# Altium schematic sheet LCD.SchDoc
size A4; SheetNumber: 6; SheetTotal: 8
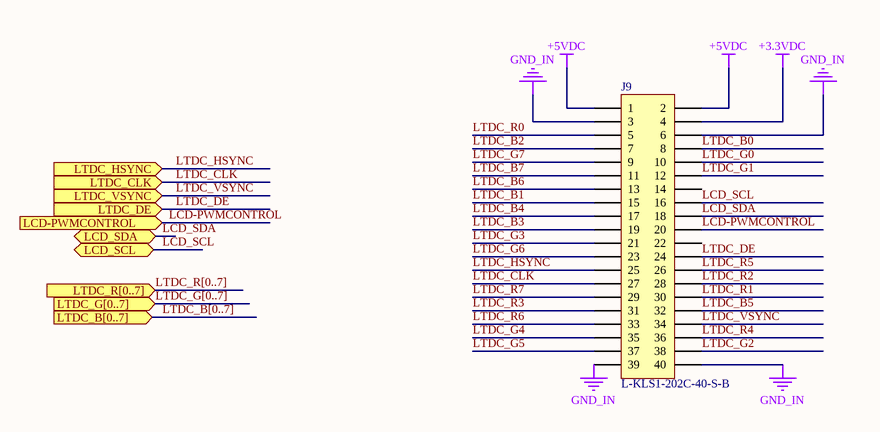
[diagram p0: LCD.SchDoc]

## Parts
J9  L-KLS1-202C-40-S-B  [L-KLS1-202C-40-T-B]

## Ports
LCD-PWMCONTROL (in, see Main[2D], MCU[1A]), LCD_SCL (bidir, see Main[2D], MCU[1A], Peripherals[1A]), LCD_SDA (bidir, see Main[2D], MCU[1A], Peripherals[1A]), LTDC_B[0..7] (in, see Main[2D], MCU[1A]), LTDC_CLK (in, see Main[2D], MCU[1A]), LTDC_DE (in, see Main[2D], MCU[1A]), LTDC_G[0..7] (in, see Main[2D], MCU[1A]), LTDC_HSYNC (in, see Main[2D], MCU[1A]), LTDC_R[0..7] (in, see Main[2D], MCU[1A]), LTDC_VSYNC (in, see Main[2D], MCU[1A])

## Nets
+3.3VDC: J9.4
+5VDC: J9.1 J9.2
GND_IN: J9.3 J9.6 J9.39 J9.40
LCD-PWMCONTROL: J9.20 ; port LCD-PWMCONTROL
LCD_SCL: J9.16 ; port LCD_SCL
LCD_SDA: J9.18 ; port LCD_SDA
LTDC_B0: J9.8
LTDC_B1: J9.15
LTDC_B2: J9.7
LTDC_B3: J9.19
LTDC_B4: J9.17
LTDC_B5: J9.32
LTDC_B6: J9.13
LTDC_B7: J9.11
LTDC_CLK: J9.27 ; port LTDC_CLK
LTDC_DE: J9.24 ; port LTDC_DE
LTDC_G0: J9.10
LTDC_G1: J9.12
LTDC_G2: J9.38
LTDC_G3: J9.21
LTDC_G4: J9.35
LTDC_G5: J9.37
LTDC_G6: J9.23
LTDC_G7: J9.9
LTDC_HSYNC: J9.25 ; port LTDC_HSYNC
LTDC_R0: J9.5
LTDC_R1: J9.30
LTDC_R2: J9.28
LTDC_R3: J9.31
LTDC_R4: J9.36
LTDC_R5: J9.26
LTDC_R6: J9.33
LTDC_R7: J9.29
LTDC_VSYNC: J9.34 ; port LTDC_VSYNC

Not connected (* = marked no-connect by the designer): J9 14 22

## Buses and harness runs
bus LTDC_B[0..7] = port LTDC_B[0..7]
bus LTDC_G[0..7] = port LTDC_G[0..7]
bus LTDC_R[0..7] = port LTDC_R[0..7]

## Library data of the parts
J9 = 2X20: BOX HEADER 40PIN(2x20) 1.27MM THT V/T MALE BLACK; Assembly: .; Value: L-KLS1-202C-40-S-B; PN: L-KLS1-202C-40-S-B; HelpURL: https://www.ozdisan.com/p/box-headerlar-295/kls-electronic-l-kls1-202c-40-s-b-531010